# Altium project LEDController_NC-1.PrjPcb (part 3 of 3)
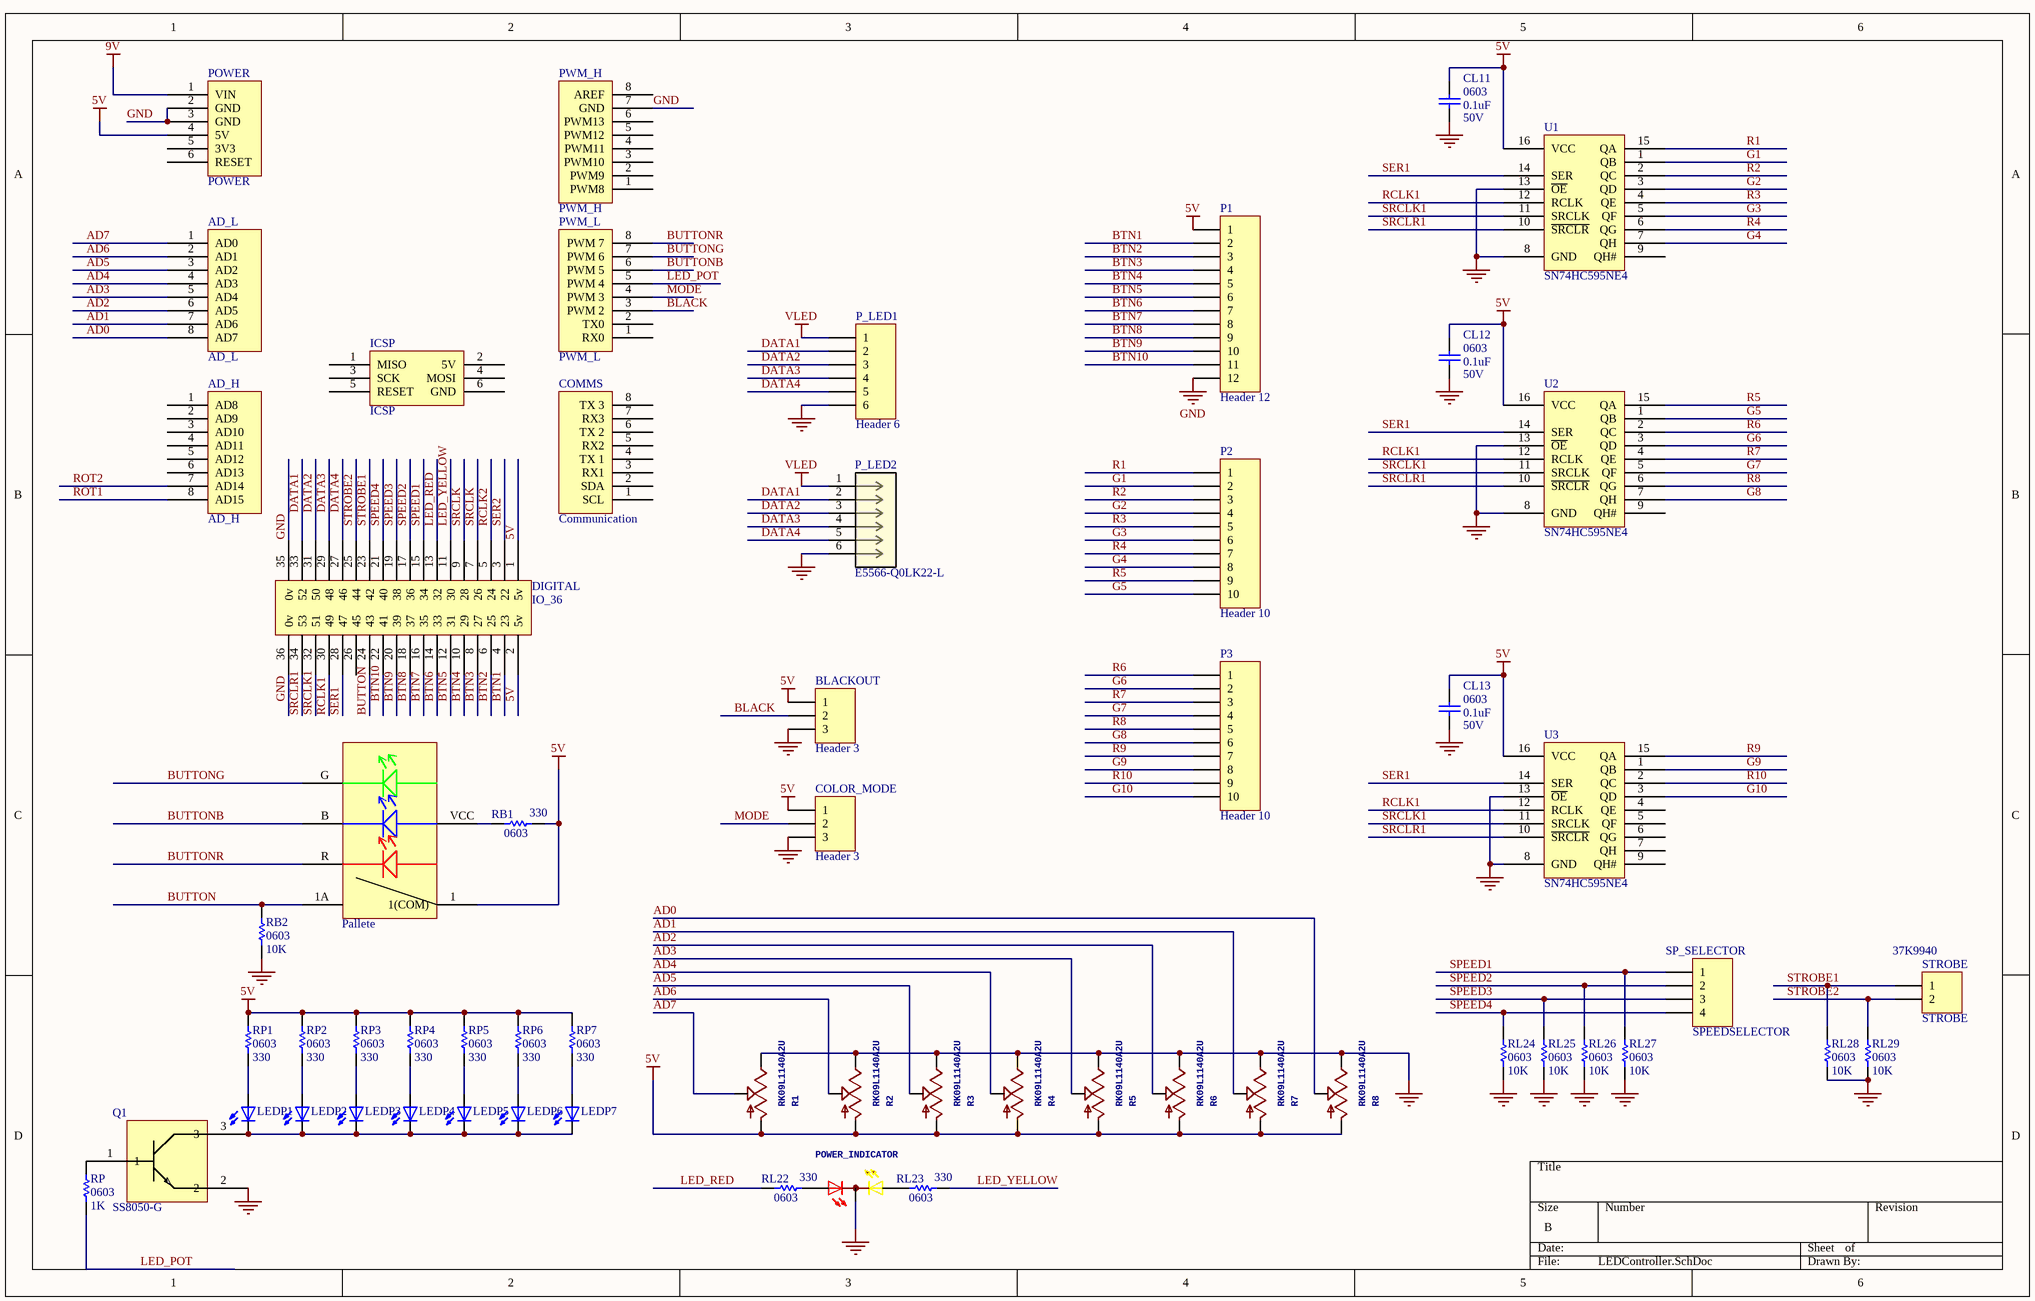
[diagram p4: LEDController.SchDoc]

## Sheet LEDController.SchDoc (continued)

### Library data of the parts
AD_H = AD_H: CONN HEADER VERT 8POS 2.54MM; Manufacturer 1: Sullins; Manufacturer Part Number 1: PREC008SFAN-RC; Number of Positions: 8; Connector Type: Male Pin; Pitch: 0.1inch; Supplier 1: Digi-Key; Supplier Part Number 1: S1212EC-08-ND; Stock 1: 3866; Pricing 1: 1=0.22000, 10=0.20200, 25=0.17200, 50=0.15060, 100=0.13980, 250=0.12364, 500=0.11828 (USD); RoHS: Yes; Mount: Through Hole; Color: Black; Contact Plating: Tin; Package Quantity: 1; Number of Rows: 1; Packaging: Bulk; Termination: Solder; Contact Mating Length: 0.318inch; ComponentLink1URL: https://datasheet.ciiva.com/740/xrxczzzsxxn-rc-st-11635-b-740957.pdf?src-supplier=Digi-Key; ComponentLink1Description: https://datasheet.ciiva.com/740/xrxczzzsxxn-rc-st-11635-b-740957.pdf?src-supplier=Digi-Key
AD_L = AD_L: CONN HEADER VERT 8POS 2.54MM; Manufacturer 1: Sullins; Manufacturer Part Number 1: PREC008SFAN-RC; Number of Positions: 8; Connector Type: Male Pin; Pitch: 0.1inch; Supplier 1: Digi-Key; Supplier Part Number 1: S1212EC-08-ND; Stock 1: 3866; Pricing 1: 1=0.22000, 10=0.20200, 25=0.17200, 50=0.15060, 100=0.13980, 250=0.12364, 500=0.11828 (USD); RoHS: Yes; Mount: Through Hole; Color: Black; Contact Plating: Tin; Package Quantity: 1; Number of Rows: 1; Packaging: Bulk; Termination: Solder; Contact Mating Length: 0.318inch; ComponentLink1URL: https://datasheet.ciiva.com/740/xrxczzzsxxn-rc-st-11635-b-740957.pdf?src-supplier=Digi-Key; ComponentLink1Description: https://datasheet.ciiva.com/740/xrxczzzsxxn-rc-st-11635-b-740957.pdf?src-supplier=Digi-Key
BLACKOUT COLOR_MODE = Header 3: CONN HEADER VERT 3POS 2MM; Manufacturer 1: JST; Number of Positions: 3; Connector Type: Male Pin; Current Rating: 2A; Contact Resistance: 20mR; Voltage Rating (AC): 100V; Insulation Resistance: 1MR; Gender: Male; LatestRevisionDate: 17-Jul-2002; LatestRevisionNote: Re-released for DXP Platform.; Publisher: Altium Limited; Supplier 1: Digi-Key; Supplier Part Number 1: 455-1705-ND; Manufacturer Part Number 1: B3B-PH-K-S(LF)(SN); Stock 1: 143844; Pricing 1: 1=0.19000, 10=0.18200, 100=0.12620, 500=0.10676, 1000=0.08736, 5000=0.07765, 10000=0.07037 (USD); RoHS: Yes; Mount: Through Hole; Number of Pins: 3; Contact Plating: Tin,Copper; Color: Natural; Contact Material: Brass,Tin; Housing Color: White; Housing Material: Polyamide; Min Operating Temperature: -25°C; Max Operating Temperature: 85°C; Number of Rows: 1; Packaging: Bulk; Max Current Rating: 2A; Number of Poles: 3; Voltage Rating: 100V; Termination: Solder; Fastening Type: Detent; Number of Contacts: 3; Max Voltage Rating (AC): 100V; Max Voltage Rating (DC): 100V; Working Voltage: 100V; Orientation: Straight; Length: 7.9mm; Height: 9.4mm; Pitch: 2mm; Width: 4.5mm; Lead Pitch: 2mm; Contact Mating Length: 0.13inch; Depth: 4.5mm; Lead Free: Lead Free; REACH SVHC: No SVHC; ComponentLink1URL: https://datasheet.ciiva.com/6747/80560-6747401.pdf?src-supplier=Newark; ComponentLink1Description: https://datasheet.ciiva.com/6747/80560-6747401.pdf?src-supplier=Newark; ComponentLink2URL: https://datasheet.ciiva.com/11746/0900766b80826550-11746939.pdf?src-supplier=RSComponents; ComponentLink2Description: https://datasheet.ciiva.com/11746/0900766b80826550-11746939.pdf?src-supplier=RSComponents; ComponentLink3URL: https://datasheet.ciiva.com/26894/getdatasheetpartid-448114-26894774.pdf?src-supplier=Verical; ComponentLink3Description: https://datasheet.ciiva.com/26894/getdatasheetpartid-448114-26894774.pdf?src-supplier=Verical; ComponentLink4URL: https://datasheet.ciiva.com/712/eph-712455.pdf?src-supplier=Digi-Key; ComponentLink4Description: https://datasheet.ciiva.com/712/eph-712455.pdf?src-supplier=Digi-Key; ComponentLink5URL: https://datasheet.ciiva.com/26924/getdatasheetpartid-651387-26924028.pdf?src-supplier=Verical; ComponentLink5Description: https://datasheet.ciiva.com/26924/getdatasheetpartid-651387-26924028.pdf?src-supplier=Verical; ComponentLink6URL: https://datasheet.ciiva.com/16200/eph-16200926.pdf?src-supplier=Future+Electronics; ComponentLink6Description: https://datasheet.ciiva.com/16200/eph-16200926.pdf?src-supplier=Future+Electronics; ComponentLink7URL: https://datasheet.ciiva.com/43491/741202-da-01-en-stiftleiste-gerade-3-pol-rm2-0-43491962.pdf?src-supplier=Conrad; ComponentLink7Description: https://datasheet.ciiva.com/43491/741202-da-01-en-stiftleiste-gerade-3-pol-rm2-0-43491962.pdf?src-supplier=Conrad
CL11-CL13 = Cap: CAP CER 0.1UF 50V X5R 0603; Manufacturer 1: Yageo; Manufacturer Part Number 1: CC0603KRX5R9BB104; Capacitance: 100nF; Tolerance: 10%; ComponentLink1URL: https://datasheet.ciiva.com/30062/tmk212bbj106kg-t-30062083.pdf?src-supplier=Onlinecomponents.com; ComponentLink1Description: https://datasheet.ciiva.com/30062/tmk212bbj106kg-t-30062083.pdf?src-supplier=Onlinecomponents.com; ComponentLink2URL: https://datasheet.ciiva.com/139/mlcc-all-e-139570.pdf?src-supplier=Digi-Key; ComponentLink2Description: https://datasheet.ciiva.com/139/mlcc-all-e-139570.pdf?src-supplier=Digi-Key; ComponentLink3URL: https://datasheet.ciiva.com/139/mlcc-all-e-139571.pdf?src-supplier=Digi-Key; ComponentLink3Description: https://datasheet.ciiva.com/139/mlcc-all-e-139571.pdf?src-supplier=Digi-Key; ComponentLink4URL: https://datasheet.ciiva.com/139/mlcc-all-e-139572.pdf?src-supplier=Digi-Key; ComponentLink4Description: https://datasheet.ciiva.com/139/mlcc-all-e-139572.pdf?src-supplier=Digi-Key; ComponentLink5URL: https://datasheet.ciiva.com/7975/1481447-7975820.pdf?src-supplier=Element14; ComponentLink5Description: https://datasheet.ciiva.com/7975/1481447-7975820.pdf?src-supplier=Element14; ComponentLink6URL: https://datasheet.ciiva.com/144/mlccorderingcode-144037.pdf?src-supplier=Digi-Key; ComponentLink6Description: https://datasheet.ciiva.com/144/mlccorderingcode-144037.pdf?src-supplier=Digi-Key; ComponentLink7URL: https://datasheet.ciiva.com/8033/1489800-8033669.pdf?src-supplier=Element14; ComponentLink7Description: https://datasheet.ciiva.com/8033/1489800-8033669.pdf?src-supplier=Element14; ComponentLink8URL: https://datasheet.ciiva.com/15189/getdatasheetpartid-321421-15189125.pdf?src-supplier=Verical; ComponentLink8Description: https://datasheet.ciiva.com/15189/getdatasheetpartid-321421-15189125.pdf?src-supplier=Verical; ComponentLink9URL: https://datasheet.ciiva.com/144/mlccorderingcode-144038.pdf?src-supplier=Digi-Key; ComponentLink9Description: https://datasheet.ciiva.com/144/mlccorderingcode-144038.pdf?src-supplier=Digi-Key; ComponentLink10URL: https://datasheet.ciiva.com/28450/1489800-28450342.pdf?src-supplier=Element14; ComponentLink10Description: https://datasheet.ciiva.com/28450/1489800-28450342.pdf?src-supplier=Element14; ComponentLink11URL: https://datasheet.ciiva.com/144/mlccorderingcode-144039.pdf?src-supplier=Digi-Key; ComponentLink11Description: https://datasheet.ciiva.com/144/mlccorderingcode-144039.pdf?src-supplier=Digi-Key; ComponentLink12URL: https://datasheet.ciiva.com/8033/1489800-8033671.pdf?src-supplier=Element14; ComponentLink12Description: https://datasheet.ciiva.com/8033/1489800-8033671.pdf?src-supplier=Element14; ComponentLink13URL: http://www.farnell.com/datasheets/1872206.pdf?src-supplier=Farnell; ComponentLink13Description: http://www.farnell.com/datasheets/1872206.pdf?src-supplier=Farnell; ComponentLink14URL: http://uk.rs-online.com/webdocs/144c/0900766b8144c113.pdf?src-supplier=RSComponents; ComponentLink14Description: http://uk.rs-online.com/webdocs/144c/0900766b8144c113.pdf?src-supplier=RSComponents; ComponentLink15URL: http://www.farnell.com/datasheets/2048008.pdf?src-supplier=Farnell; ComponentLink15Description: http://www.farnell.com/datasheets/2048008.pdf?src-supplier=Farnell; ComponentLink16URL: http://www.mouser.com/ds/2/281/c02e-2905.pdf?src-supplier=Mouser; ComponentLink16Description: http://www.mouser.com/ds/2/281/c02e-2905.pdf?src-supplier=Mouser; ComponentLink17URL: http://components.arrow.com/part/dataview/0323_06361249?src-supplier=Arrow+Europe; ComponentLink17Description: http://components.arrow.com/part/dataview/0323_06361249?src-supplier=Arrow+Europe; ComponentLink18URL: https://search.murata.co.jp/Ceramy/image/img/A01X/G101/ENG/GRM155R71E104KE14-01.pdf?src-supplier=Digi-Key; ComponentLink18Description: https://search.murata.co.jp/Ceramy/image/img/A01X/G101/ENG/GRM155R71E104KE14-01.pdf?src-supplier=Digi-Key; ComponentLink19URL: http://www.farnell.com/datasheets/2048008.pdf?src-supplier=Newark; ComponentLink19Description: http://www.farnell.com/datasheets/2048008.pdf?src-supplier=Newark; ComponentLink20URL: http://psearch.en.murata.com/capacitor/product/GRM155R71E104KE14%23.pdf?src-supplier=Avnet; ComponentLink20Description: http://psearch.en.murata.com/capacitor/product/GRM155R71E104KE14%23.pdf?src-supplier=Avnet; ComponentLink21URL: http://www.farnell.com/datasheets/2048008.pdf?src-supplier=Element14; ComponentLink21Description: http://www.farnell.com/datasheets/2048008.pdf?src-supplier=Element14; Supplier 1: Digi-Key; Supplier Part Number 1: 311-4046-1-ND; Stock 1: 3816; Pricing 1: 1=0.10000, 10=0.05600, 50=0.03080, 100=0.02510, 500=0.01794, 1000=0.01410 (USD); RoHS: Yes; Mount: Surface Mount; Case/Package: 0603; Case Code (Imperial): 0603; Case Code (Metric): 1608; Weight: 7.1E-05oz; Min Operating Temperature: -55°C; Max Operating Temperature: 85°C; Packaging: Tape and Reel; Dielectric: X5R; Termination: SMD/SMT; Voltage Rating (DC): 50V; Package Quantity: 4000; Length: 0.063inch; Width: 0.031inch; Thickness: 0.035inch; Lead Free: Lead Free; Halogen Free: Halogen Free; ComponentLink22URL: http://www.mouser.com/ds/2/447/Yageo_UPY-GP_NP0_16V-to-50V_9-358835.pdf?src-supplier=Mouser; ComponentLink22Description: http://www.mouser.com/ds/2/447/Yageo_UPY-GP_NP0_16V-to-50V_9-358835.pdf?src-supplier=Mouser; ComponentLink23URL: http://www.yageo.com/documents/recent/UPY-GPHC_X5R_4V-to-50V_25.pdf?src-supplier=Digi-Key; ComponentLink23Description: http://www.yageo.com/documents/recent/UPY-GPHC_X5R_4V-to-50V_25.pdf?src-supplier=Digi-Key; ComponentLink24URL: http://www.yageo.com/exep/pages/download/literatures/ProductSelectionGuide%202014_Final_2.pdf?src-supplier=Digi-Key; ComponentLink24Description: http://www.yageo.com/exep/pages/download/literatures/ProductSelectionGuide%202014_Final_2.pdf?src-supplier=Digi-Key
COMMS = Communication: CONN HEADER VERT 8POS 2.54MM; Manufacturer 1: Sullins; Manufacturer Part Number 1: PREC008SFAN-RC; Number of Positions: 8; Connector Type: Male Pin; Pitch: 0.1inch; Supplier 1: Digi-Key; Supplier Part Number 1: S1212EC-08-ND; Stock 1: 3866; Pricing 1: 1=0.22000, 10=0.20200, 25=0.17200, 50=0.15060, 100=0.13980, 250=0.12364, 500=0.11828 (USD); RoHS: Yes; Mount: Through Hole; Color: Black; Contact Plating: Tin; Package Quantity: 1; Number of Rows: 1; Packaging: Bulk; Termination: Solder; Contact Mating Length: 0.318inch; ComponentLink1URL: https://datasheet.ciiva.com/740/xrxczzzsxxn-rc-st-11635-b-740957.pdf?src-supplier=Digi-Key; ComponentLink1Description: https://datasheet.ciiva.com/740/xrxczzzsxxn-rc-st-11635-b-740957.pdf?src-supplier=Digi-Key
DIGITAL = IO_36: CONN HEADER VERT 36POS 2.54MM; Manufacturer 1: Sullins; Manufacturer Part Number 1: PREC018DFAN-RC; Number of Positions: 36; Connector Type: Male Pin; Pitch: 0.1inch; Supplier 1: Digi-Key; Supplier Part Number 1: S2212EC-18-ND; Stock 1: 291; Pricing 1: 1=0.77000, 10=0.72600, 25=0.65320, 50=0.58060, 100=0.55640, 250=0.50804, 500=0.48384 (USD); RoHS: Yes; Mount: Through Hole; Color: Black; Contact Plating: Tin; Package Quantity: 1; Number of Rows: 2; Packaging: Bulk; Termination: Solder; Series: -; Contact Type: Male Pin; Row Spacing: 0.1inch; Contact Mating Length: 0.318inch; RoHS Compliant: Yes; ComponentLink1URL: https://datasheet.ciiva.com/740/xrxczzzdxxn-rc-11636-b-740987.pdf?src-supplier=Digi-Key; ComponentLink1Description: https://datasheet.ciiva.com/740/xrxczzzdxxn-rc-11636-b-740987.pdf?src-supplier=Digi-Key
LEDP1-LEDP7 = 150060AS75000: Amber 605nm LED Indication - Discrete 2V 0603 (1608 Metric); Manufacturer 1: Wurth Electronics; ComponentLink1URL: http://optoelectronics.liteon.com/upload/download/DS22-2000-074/S_110_LTST-C190KGKT.pdf; ComponentLink1Description: http://optoelectronics.liteon.com/upload/download/DS22-2000-074/S_110_LTST-C190KGKT.pdf; ComponentLink2URL: https://datasheet.ciiva.com/19482/1260381-19482354.pdf?src-supplier=Jameco; ComponentLink2Description: https://datasheet.ciiva.com/19482/1260381-19482354.pdf?src-supplier=Jameco; ComponentLink3URL: https://datasheet.ciiva.com/12403/100-ltst-c190krkt-59805-12403895.pdf?src-supplier=Mouser; ComponentLink3Description: https://datasheet.ciiva.com/12403/100-ltst-c190krkt-59805-12403895.pdf?src-supplier=Mouser; ComponentLink4URL: https://datasheet.ciiva.com/15117/getdatasheetpartid-57395-15117240.pdf?src-supplier=Verical; ComponentLink4Description: https://datasheet.ciiva.com/15117/getdatasheetpartid-57395-15117240.pdf?src-supplier=Verical; ComponentLink5URL: https://datasheet.ciiva.com/16427/ltst-c190krkt-16427674.pdf?src-supplier=Future+Electronics; ComponentLink5Description: https://datasheet.ciiva.com/16427/ltst-c190krkt-16427674.pdf?src-supplier=Future+Electronics; ComponentLink6URL: https://datasheet.ciiva.com/11774/0900766b80dc02a9-11774043.pdf?src-supplier=RSComponents; ComponentLink6Description: https://datasheet.ciiva.com/11774/0900766b80dc02a9-11774043.pdf?src-supplier=RSComponents; ComponentLink7URL: https://datasheet.ciiva.com/26937/getdatasheetpartid-631582-26937958.pdf?src-supplier=Verical; ComponentLink7Description: https://datasheet.ciiva.com/26937/getdatasheetpartid-631582-26937958.pdf?src-supplier=Verical; ComponentLink8URL: https://datasheet.ciiva.com/2109/s-110-ltst-c190krkt-2109991.pdf?src-supplier=Digi-Key; ComponentLink8Description: https://datasheet.ciiva.com/2109/s-110-ltst-c190krkt-2109991.pdf?src-supplier=Digi-Key; ComponentLink9URL: https://datasheet.ciiva.com/2109/s-110-ltst-c190krkt-2109992.pdf?src-supplier=Digi-Key; ComponentLink9Description: https://datasheet.ciiva.com/2109/s-110-ltst-c190krkt-2109992.pdf?src-supplier=Digi-Key; ComponentLink10URL: https://datasheet.ciiva.com/2109/s-110-ltst-c190krkt-2109993.pdf?src-supplier=Digi-Key; ComponentLink10Description: https://datasheet.ciiva.com/2109/s-110-ltst-c190krkt-2109993.pdf?src-supplier=Digi-Key; Supplier 1: Digi-Key; Manufacturer Part Number 1: 150060AS75000; Stock 1: 5248; Pricing 1: 1=0.14000, 50=0.13300, 100=0.11400, 500=0.09900 (USD); RoHS: No; ComponentLink11URL: http://www.farnell.com/datasheets/2621639.pdf?src-supplier=Farnell; ComponentLink11Description: http://www.farnell.com/datasheets/2621639.pdf?src-supplier=Farnell; ComponentLink12URL: http://www.farnell.com/datasheets/2621639.pdf?src-supplier=Element14; ComponentLink12Description: http://www.farnell.com/datasheets/2621639.pdf?src-supplier=Element14; ComponentLink13URL: http://www.farnell.com/datasheets/2621639.pdf?src-supplier=Newark; ComponentLink13Description: http://www.farnell.com/datasheets/2621639.pdf?src-supplier=Newark; Supplier Part Number 1: 732-150060AS75000CT-ND
P1 = Header 12: CONN HEADER VERT 12POS 2.54MM; Manufacturer 1: Sullins; Manufacturer Part Number 1: PREC012SFAN-RC; Number of Positions: 12; Connector Type: Male Pin; Pitch: 0.1inch; ComponentLink1URL: https://datasheet.ciiva.com/740/xrxczzzsxxn-rc-st-11635-b-740955.pdf?src-supplier=Digi-Key; ComponentLink1Description: https://datasheet.ciiva.com/740/xrxczzzsxxn-rc-st-11635-b-740955.pdf?src-supplier=Digi-Key; Supplier 1: Digi-Key; Supplier Part Number 1: S1212EC-12-ND; Stock 1: 741; Pricing 1: 1=0.30000, 10=0.28200, 25=0.24200, 50=0.20560, 100=0.19760, 250=0.17740, 500=0.16934 (USD); RoHS: Yes; Mount: Through Hole; Contact Plating: Tin; Color: Black; Termination: Solder; Package Quantity: 1; Number of Rows: 1; Packaging: Bulk; Contact Mating Length: 0.318inch; ComponentLink2URL: https://datasheet.ciiva.com/740/xrxczzzsxxn-rc-st-11635-b-740953.pdf?src-supplier=Digi-Key; ComponentLink2Description: https://datasheet.ciiva.com/740/xrxczzzsxxn-rc-st-11635-b-740953.pdf?src-supplier=Digi-Key
P2 P3 = Header 10: CONN HEADER VERT 10POS 2.54MM; Manufacturer 1: Sullins; Manufacturer Part Number 1: PREC010SFAN-RC; Number of Positions: 10; Connector Type: Male Pin; Pitch: 0.1inch; LatestRevisionDate: 17-Jul-2002; LatestRevisionNote: Re-released for DXP Platform.; Publisher: Altium Limited; Supplier 1: Digi-Key; Supplier Part Number 1: S1212EC-10-ND; Stock 1: 7881; Pricing 1: 1=0.27000, 10=0.25200, 25=0.21520, 50=0.18820, 100=0.17470, 250=0.15456, 500=0.14784 (USD); RoHS: Yes; Mount: Through Hole; Color: Black; Contact Plating: Tin; Termination: Solder; Package Quantity: 1; Number of Rows: 1; Packaging: Bulk; Contact Mating Length: 0.318inch; ComponentLink1URL: https://datasheet.ciiva.com/740/xrxczzzsxxn-rc-st-11635-b-740955.pdf?src-supplier=Digi-Key; ComponentLink1Description: https://datasheet.ciiva.com/740/xrxczzzsxxn-rc-st-11635-b-740955.pdf?src-supplier=Digi-Key
P_LED1 = Header 6: CONN HEADER VERT 6POS 2.54MM; Manufacturer 1: Sullins; Manufacturer Part Number 1: PREC006SFAN-RC; Number of Positions: 6; Connector Type: Male Pin; Pitch: 0.1inch; LatestRevisionDate: 17-Jul-2002; LatestRevisionNote: Re-released for DXP Platform.; Publisher: Altium Limited; Supplier 1: Digi-Key; Supplier Part Number 1: S1212EC-06-ND; Stock 1: 3553; Pricing 1: 1=0.16000, 10=0.15100, 25=0.12920, 50=0.11280, 100=0.10480, 250=0.09272, 500=0.08870 (USD); RoHS: Yes; Mount: Through Hole; Color: Black; Contact Plating: Tin; Package Quantity: 1; Number of Rows: 1; Packaging: Bulk; Termination: Solder; Series: -; Contact Type: Male Pin; Contact Mating Length: 0.318inch; RoHS Compliant: Yes; ComponentLink1URL: https://datasheet.ciiva.com/740/xrxczzzsxxn-rc-st-11635-b-740959.pdf?src-supplier=Digi-Key; ComponentLink1Description: https://datasheet.ciiva.com/740/xrxczzzsxxn-rc-st-11635-b-740959.pdf?src-supplier=Digi-Key
P_LED2 = E5566-Q0LK22-L: CONN MOD JACK 6P6C R/A UNSHLD; Manufacturer 1: Pulse; Built_By: EMA_Don; Vendor: Pulse Electronics Corporation; SourceLibrary: Pulse_Electronics_2018-08-17; Number of Ports: 1; Direction: Up; Number of Contacts: 6; Shielding: Unshielded; Pitch: 1.02mm; Copyright: Copyright (C) 2016 Accelerated Designs. All rights reserved; Manufacturer_Part_Number: E5566-Q0LK22-L; RefDes: RefDes; Type: DEV; Supplier 1: Digi-Key; Manufacturer Part Number 1: E5566-Q0LK22-L; Stock 1: 13841; Pricing 1: 1=0.54000, 10=0.51000, 25=0.45920, 50=0.40800, 100=0.39100, 250=0.35700, 500=0.34000, 1000=0.28050, 2500=0.25500 (USD); RoHS: Yes; Mount: Through Hole; Housing Material: Nylon; Contact Plating: Gold; Contact Material: Bronze; Min Operating Temperature: -40°C; Max Operating Temperature: 85°C; Termination: Solder; Packaging: Bulk; Package Quantity: 4080; Orientation: Right Angle; Number of Rows: 1; Connector Type: Jack; Radiation Hardening: No; ComponentLink1URL: https://datasheet.ciiva.com/686/+ce553027-lc-686555.pdf?src-supplier=Digi-Key; ComponentLink1Description: https://datasheet.ciiva.com/686/+ce553027-lc-686555.pdf?src-supplier=Digi-Key; Supplier Part Number 1: 553-2258-ND
Pallete = KP0115ANBKG03RGB-2SJB: Pushbutton Switch SPST-NO Standard, Illuminated Through Hole; Manufacturer 1: NKK Switches; Actuator Material: Polyacetal; Mechanical Life: 5000000Cycles; Illumination Color: Blue,Green,Red; Throw Configuration: SPST; Max Current Rating: 100mA; Illumination Type: LED; Voltage Rating (DC): 12V; Actuator Type: Square, Button; Switch Function: Off-Mom; Supplier 1: Digi-Key; Manufacturer Part Number 1: KP0115ANBKG03RGB-2SJB; Stock 1: 22; Pricing 1: 1=20.27000, 10=18.40500, 25=17.57800, 50=16.64740, 100=16.02700, 250=14.99300, 500=12.40800 (USD); RoHS: Yes; Mount: Through Hole; Contact Material: Stainless Steel; Contact Plating: Gold; Housing Material: Glass fibre; Min Operating Temperature: -25°C; Max Operating Temperature: 50°C; Current Rating: 100mA; Package Quantity: 1; Packaging: Bulk; Max Voltage Rating (DC): 12V; Termination: PC Pins; Electrical Life: 5000000Cycles; Length: 17.4mm; Depth: 17.4mm; Lead Free: Lead Free; ComponentLink1URL: https://datasheet.ciiva.com/16864/70192969-16864678.pdf?src-supplier=Allied+Electronics; ComponentLink1Description: https://datasheet.ciiva.com/16864/70192969-16864678.pdf?src-supplier=Allied+Electronics; ComponentLink2URL: https://datasheet.ciiva.com/2870/kp01-2870071.pdf?src-supplier=Digi-Key; ComponentLink2Description: https://datasheet.ciiva.com/2870/kp01-2870071.pdf?src-supplier=Digi-Key; Supplier Part Number 1: 360-2465-ND
POWER = POWER: CONN HEADER VERT 6POS 2.54MM; Manufacturer 1: Sullins; Manufacturer Part Number 1: PREC006SFAN-RC; Number of Positions: 6; Connector Type: Male Pin; Pitch: 0.1inch; Supplier 1: Digi-Key; Supplier Part Number 1: S1212EC-06-ND; Stock 1: 3553; Pricing 1: 1=0.16000, 10=0.15100, 25=0.12920, 50=0.11280, 100=0.10480, 250=0.09272, 500=0.08870 (USD); RoHS: Yes; Mount: Through Hole; Color: Black; Contact Plating: Tin; Package Quantity: 1; Number of Rows: 1; Packaging: Bulk; Termination: Solder; Series: -; Contact Type: Male Pin; Contact Mating Length: 0.318inch; RoHS Compliant: Yes; ComponentLink1URL: https://datasheet.ciiva.com/740/xrxczzzsxxn-rc-st-11635-b-740959.pdf?src-supplier=Digi-Key; ComponentLink1Description: https://datasheet.ciiva.com/740/xrxczzzsxxn-rc-st-11635-b-740959.pdf?src-supplier=Digi-Key
POWER_INDICATOR = WP59EYW: Red, Yellow 617nm Red, 588nm Yellow LED Indication - Discrete 2V Red, 2.1V Yellow Radial - 3 Leads; Manufacturer 1: Kingbright; Lens Color: White; Test Current: 20mA; Forward Current: 30mA; Number of LEDs: 1; Lens Style: Dome,Diffused,Round; Viewing Angle: 60°; Luminous Intensity: 40mcd; Wavelength: 568nm; Supplier 1: Digi-Key; Manufacturer Part Number 1: WP59EYW; Stock 1: 1988; Pricing 1: 1=0.62000, 10=0.44600, 100=0.29120, 500=0.20930, 1000=0.16380, 2500=0.15015, 5000=0.13650, 10000=0.12740, 25000=0.12285 (USD); RoHS: Yes; Mount: Through Hole; Case/Package: Radial; Number of Pins: 5; Color: Red,Yellow; Min Operating Temperature: -40°C; Max Operating Temperature: 85°C; Dominant Wavelength: 588nm; Forward Voltage: 2.1V; Package Quantity: 500; Illumination Color: Red,Yellow; Packaging: Bulk; Height: 8.6mm; Lead Free: Lead Free; ComponentLink1URL: https://datasheet.ciiva.com/16366/wp59eyw-16366834.pdf?src-supplier=Future+Electronics; ComponentLink1Description: https://datasheet.ciiva.com/16366/wp59eyw-16366834.pdf?src-supplier=Future+Electronics; ComponentLink2URL: https://datasheet.ciiva.com/13500/wp59eyw-45838-13500845.pdf?src-supplier=Mouser; ComponentLink2Description: https://datasheet.ciiva.com/13500/wp59eyw-45838-13500845.pdf?src-supplier=Mouser; ComponentLink3URL: https://datasheet.ciiva.com/14604/70062955-14604373.pdf?src-supplier=Allied+Electronics; ComponentLink3Description: https://datasheet.ciiva.com/14604/70062955-14604373.pdf?src-supplier=Allied+Electronics; Supplier Part Number 1: 754-1233-ND
PWM_H = PWM_H: CONN HEADER VERT 8POS 2.54MM; Manufacturer 1: Sullins; Manufacturer Part Number 1: PREC008SFAN-RC; Number of Positions: 8; Connector Type: Male Pin; Pitch: 0.1inch; Supplier 1: Digi-Key; Supplier Part Number 1: S1212EC-08-ND; Stock 1: 3866; Pricing 1: 1=0.22000, 10=0.20200, 25=0.17200, 50=0.15060, 100=0.13980, 250=0.12364, 500=0.11828 (USD); RoHS: Yes; Mount: Through Hole; Color: Black; Contact Plating: Tin; Package Quantity: 1; Number of Rows: 1; Packaging: Bulk; Termination: Solder; Contact Mating Length: 0.318inch; ComponentLink1URL: https://datasheet.ciiva.com/740/xrxczzzsxxn-rc-st-11635-b-740957.pdf?src-supplier=Digi-Key; ComponentLink1Description: https://datasheet.ciiva.com/740/xrxczzzsxxn-rc-st-11635-b-740957.pdf?src-supplier=Digi-Key
PWM_L = PWM_L: CONN HEADER VERT 8POS 2.54MM; Manufacturer 1: Sullins; Manufacturer Part Number 1: PREC008SFAN-RC; Number of Positions: 8; Connector Type: Male Pin; Pitch: 0.1inch; Supplier 1: Digi-Key; Supplier Part Number 1: S1212EC-08-ND; Stock 1: 3866; Pricing 1: 1=0.22000, 10=0.20200, 25=0.17200, 50=0.15060, 100=0.13980, 250=0.12364, 500=0.11828 (USD); RoHS: Yes; Mount: Through Hole; Color: Black; Contact Plating: Tin; Package Quantity: 1; Number of Rows: 1; Packaging: Bulk; Termination: Solder; Contact Mating Length: 0.318inch; ComponentLink1URL: https://datasheet.ciiva.com/740/xrxczzzsxxn-rc-st-11635-b-740957.pdf?src-supplier=Digi-Key; ComponentLink1Description: https://datasheet.ciiva.com/740/xrxczzzsxxn-rc-st-11635-b-740957.pdf?src-supplier=Digi-Key
Q1 = SS8050-G: Bipolar (BJT) Transistor NPN 25V 1.5A 100MHz 300mW Surface Mount SOT-23; Vendor: Comchip; Built_By: EMA_Kyle; SourceLibrary: Comchip_2020-02-14; Type: DEV; Collector Emitter Voltage (VCEO): 400mV; Manufacturer_Part_Number: SS8050-G; Copyright: Copyright (C) 2018 Accelerated Designs. All rights reserved; RefDes: RefDes; Supplier 1: Digi-Key; Manufacturer 1: Comchip; Manufacturer Part Number 1: SS8050-G; Stock 1: 8356; Pricing 1: 1=0.21000, 10=0.17400, 25=0.14600, 100=0.07130, 500=0.05946, 1000=0.04131 (USD); RoHS: Yes; Mount: Surface Mount; Case/Package: TO-236-3; Packaging: Tape and Reel; Max Collector Current: 1.5A; Max Power Dissipation: 300mW; Transition Frequency: 100MHz; Collector Emitter Breakdown Voltage: 25V; Max Breakdown Voltage: 25V; ComponentLink1URL: http://www.comchiptech.com/admin/files/product/SS8050-G RevA181526.pdf?src-supplier=Digi-Key; ComponentLink1Description: http://www.comchiptech.com/admin/files/product/SS8050-G RevA181526.pdf?src-supplier=Digi-Key; ComponentLink2URL: http://www.comchiptech.com/cms/UserFiles/SS8050-G%20RevA181526.pdf?src-supplier=Digi-Key; ComponentLink2Description: http://www.comchiptech.com/cms/UserFiles/SS8050-G%20RevA181526.pdf?src-supplier=Digi-Key; Supplier Part Number 1: 641-1790-1-ND
R1-R8 = US-EVUM: Potentiometers Sgl Unit Vert Flat Snap-in 10K Ohms 20%; Manufacturer 1: Alps Electric; Resistance: 10kR; Power Rating: 50mW; Number of Turns: 1; Hole Diameter: 9mm; ComponentLink1URL: https://datasheet.ciiva.com/30236/aok0000ce4-30236166.pdf?src-supplier=Onlinecomponents.com; ComponentLink1Description: https://datasheet.ciiva.com/30236/aok0000ce4-30236166.pdf?src-supplier=Onlinecomponents.com; ComponentLink2URL: https://datasheet.ciiva.com/16928/70270572-16928811.pdf?src-supplier=Allied+Electronics; ComponentLink2Description: https://datasheet.ciiva.com/16928/70270572-16928811.pdf?src-supplier=Allied+Electronics; ComponentLink3URL: https://datasheet.ciiva.com/48425/p260-eng-tds-48425286.pdf?src-supplier=Distrelec; ComponentLink3Description: https://datasheet.ciiva.com/48425/p260-eng-tds-48425286.pdf?src-supplier=Distrelec; Supplier 1: Mouser; Supplier Part Number 1: 688-RK09L1140A2U; Manufacturer Part Number 1: RK09L1140A2U; Stock 1: 3048; Pricing 1: 1=1.49000, 25=1.31000, 50=1.23000, 100=1.19000, 500=1.10000, 1000=1.07000 (USD); RoHS: Yes; Mount: Panel,Brackets,Through Hole; Min Operating Temperature: -10°C; Max Operating Temperature: 70°C; Tolerance: 20%; Type: Potentiometer; Packaging: Tray; Resistor Type: Potentiometer; Taper: Linear; Termination: Pin; Length: 10.7mm; Depth: 7.45mm; Radiation Hardening: No; ComponentLink4URL: https://datasheet.ciiva.com/11831/0900766b80f4c570-11831530.pdf?src-supplier=RSComponents; ComponentLink4Description: https://datasheet.ciiva.com/11831/0900766b80f4c570-11831530.pdf?src-supplier=RSComponents
RB1 RL22 RL23 RP1-RP7 = Res1: RES SMD 330 OHM 1% 1/10W 0603; Manufacturer 1: Yageo; Manufacturer Part Number 1: RC0603FR-07330RL; Max Power Dissipation: 100mW; Temperature Coefficient: 100ppm/°C; Voltage Rating (DC): 50V; Resistance: 330R; ComponentLink1URL: https://datasheet.ciiva.com/11819/0900766b80c66297-11819490.pdf?src-supplier=RSComponents; ComponentLink1Description: https://datasheet.ciiva.com/11819/0900766b80c66297-11819490.pdf?src-supplier=RSComponents; ComponentLink2URL: https://datasheet.ciiva.com/7849/1018594-7849962.pdf?src-supplier=Element14; ComponentLink2Description: https://datasheet.ciiva.com/7849/1018594-7849962.pdf?src-supplier=Element14; ComponentLink3URL: https://datasheet.ciiva.com/17083/pyu-rc0402-51-rohs-l-6-r-17083994.pdf?src-supplier=Future+Electronics; ComponentLink3Description: https://datasheet.ciiva.com/17083/pyu-rc0402-51-rohs-l-6-r-17083994.pdf?src-supplier=Future+Electronics; ComponentLink4URL: https://datasheet.ciiva.com/7849/1018594-7849963.pdf?src-supplier=Element14; ComponentLink4Description: https://datasheet.ciiva.com/7849/1018594-7849963.pdf?src-supplier=Element14; ComponentLink5URL: https://datasheet.ciiva.com/2453/pyu-r-int-thick-7-2453661.pdf?src-supplier=Digi-Key; ComponentLink5Description: https://datasheet.ciiva.com/2453/pyu-r-int-thick-7-2453661.pdf?src-supplier=Digi-Key; ComponentLink6URL: https://datasheet.ciiva.com/2453/pyu-r-int-thick-7-2453662.pdf?src-supplier=Digi-Key; ComponentLink6Description: https://datasheet.ciiva.com/2453/pyu-r-int-thick-7-2453662.pdf?src-supplier=Digi-Key; ComponentLink7URL: https://datasheet.ciiva.com/2453/pyu-r-int-thick-7-2453663.pdf?src-supplier=Digi-Key; ComponentLink7Description: https://datasheet.ciiva.com/2453/pyu-r-int-thick-7-2453663.pdf?src-supplier=Digi-Key; ComponentLink8URL: https://datasheet.ciiva.com/12656/pyu-rc0402-51-rohs-l-6-r-12656815.pdf?src-supplier=Mouser; ComponentLink8Description: https://datasheet.ciiva.com/12656/pyu-rc0402-51-rohs-l-6-r-12656815.pdf?src-supplier=Mouser; Supplier 1: Digi-Key; Supplier Part Number 1: 311-330HRCT-ND; Stock 1: 3885547; Pricing 1: 1=0.10000, 10=0.02300, 100=0.00940, 1000=0.00421, 2500=0.00366 (USD); RoHS: Yes; Case/Package: 0603; Number of Pins: 2; Case Code (Metric): 1608; Case Code (Imperial): 0603; Min Operating Temperature: -55°C; Max Operating Temperature: 155°C; Composition: Thick Film; Features: Moisture Resistant; Number of Terminations: 2; Termination: SMD/SMT; Power Rating: 100mW; Tolerance: 1%; Voltage Rating: 50V; Packaging: Tape and Reel; Package Quantity: 1; Length: 1.6mm; Height: 0.45mm; Depth: 0.8mm; Width: 0.8mm; Lead Free: Lead Free; REACH SVHC: No SVHC; ComponentLink9URL: https://datasheet.ciiva.com/11819/0900766b80f96399-11819327.pdf?src-supplier=RSComponents; ComponentLink9Description: https://datasheet.ciiva.com/11819/0900766b80f96399-11819327.pdf?src-supplier=RSComponents; ComponentLink10URL: https://datasheet.ciiva.com/2454/pyu-r-int-thick-7-2454864.pdf?src-supplier=Digi-Key; ComponentLink10Description: https://datasheet.ciiva.com/2454/pyu-r-int-thick-7-2454864.pdf?src-supplier=Digi-Key; ComponentLink11URL: https://datasheet.ciiva.com/2454/pyu-r-int-thick-7-2454865.pdf?src-supplier=Digi-Key; ComponentLink11Description: https://datasheet.ciiva.com/2454/pyu-r-int-thick-7-2454865.pdf?src-supplier=Digi-Key; ComponentLink12URL: https://datasheet.ciiva.com/2454/pyu-r-int-thick-7-2454866.pdf?src-supplier=Digi-Key; ComponentLink12Description: https://datasheet.ciiva.com/2454/pyu-r-int-thick-7-2454866.pdf?src-supplier=Digi-Key; ComponentLink13URL: https://datasheet.ciiva.com/12555/rc0603-272842-12555334.pdf?src-supplier=Mouser; ComponentLink13Description: https://datasheet.ciiva.com/12555/rc0603-272842-12555334.pdf?src-supplier=Mouser; ComponentLink14URL: https://datasheet.ciiva.com/46440/1868787-46440904.pdf?src-supplier=Element14; ComponentLink14Description: https://datasheet.ciiva.com/46440/1868787-46440904.pdf?src-supplier=Element14; ComponentLink15URL: https://datasheet.ciiva.com/7746/443971-7746329.pdf?src-supplier=Element14; ComponentLink15Description: https://datasheet.ciiva.com/7746/443971-7746329.pdf?src-supplier=Element14; ComponentLink16URL: https://datasheet.ciiva.com/7746/443971-7746330.pdf?src-supplier=Element14; ComponentLink16Description: https://datasheet.ciiva.com/7746/443971-7746330.pdf?src-supplier=Element14; ComponentLink17URL: https://datasheet.ciiva.com/7746/1686128-7746331.pdf?src-supplier=Element14; ComponentLink17Description: https://datasheet.ciiva.com/7746/1686128-7746331.pdf?src-supplier=Element14
RB2 RL24-RL29 = Res1: RES SMD 10K OHM 5% 1/10W 0603; Manufacturer 1: Yageo; Manufacturer Part Number 1: RC0603JR-0710KL; Resistance: 10kR; Voltage Rating (DC): 50V; Temperature Coefficient: 100ppm/°C; Power Rating: 100mW; ComponentLink1URL: https://datasheet.ciiva.com/2452/pyu-r-int-thick-7-2452944.pdf?src-supplier=Digi-Key; ComponentLink1Description: https://datasheet.ciiva.com/2452/pyu-r-int-thick-7-2452944.pdf?src-supplier=Digi-Key; ComponentLink2URL: https://datasheet.ciiva.com/2452/pyu-r-int-thick-7-2452945.pdf?src-supplier=Digi-Key; ComponentLink2Description: https://datasheet.ciiva.com/2452/pyu-r-int-thick-7-2452945.pdf?src-supplier=Digi-Key; ComponentLink3URL: https://datasheet.ciiva.com/2452/pyu-r-int-thick-7-2452946.pdf?src-supplier=Digi-Key; ComponentLink3Description: https://datasheet.ciiva.com/2452/pyu-r-int-thick-7-2452946.pdf?src-supplier=Digi-Key; ComponentLink4URL: https://datasheet.ciiva.com/7746/443971-7746453.pdf?src-supplier=Element14; ComponentLink4Description: https://datasheet.ciiva.com/7746/443971-7746453.pdf?src-supplier=Element14; ComponentLink5URL: https://datasheet.ciiva.com/7746/443971-7746454.pdf?src-supplier=Element14; ComponentLink5Description: https://datasheet.ciiva.com/7746/443971-7746454.pdf?src-supplier=Element14; ComponentLink6URL: https://datasheet.ciiva.com/6063/1868787-6063175.pdf?src-supplier=Farnell; ComponentLink6Description: https://datasheet.ciiva.com/6063/1868787-6063175.pdf?src-supplier=Farnell; ComponentLink7URL: https://datasheet.ciiva.com/15189/getdatasheetpartid-329325-15189851.pdf?src-supplier=Verical; ComponentLink7Description: https://datasheet.ciiva.com/15189/getdatasheetpartid-329325-15189851.pdf?src-supplier=Verical; ComponentLink8URL: https://datasheet.ciiva.com/11808/0900766b80f96399-11808081.pdf?src-supplier=RSComponents; ComponentLink8Description: https://datasheet.ciiva.com/11808/0900766b80f96399-11808081.pdf?src-supplier=RSComponents; ComponentLink9URL: https://datasheet.ciiva.com/25906/pyu-rc0603-51-rohs-l-4-25906933.pdf?src-supplier=Avnet+Europe; ComponentLink9Description: https://datasheet.ciiva.com/25906/pyu-rc0603-51-rohs-l-4-25906933.pdf?src-supplier=Avnet+Europe; ComponentLink10URL: https://datasheet.ciiva.com/7660/1868787-7660790.pdf?src-supplier=Element14; ComponentLink10Description: https://datasheet.ciiva.com/7660/1868787-7660790.pdf?src-supplier=Element14; ComponentLink11URL: https://datasheet.ciiva.com/7746/1738695-7746279.pdf?src-supplier=Element14; ComponentLink11Description: https://datasheet.ciiva.com/7746/1738695-7746279.pdf?src-supplier=Element14; ComponentLink12URL: https://datasheet.ciiva.com/7746/1686128-7746280.pdf?src-supplier=Element14; ComponentLink12Description: https://datasheet.ciiva.com/7746/1686128-7746280.pdf?src-supplier=Element14; ComponentLink13URL: https://datasheet.ciiva.com/28386/pyu-rc0603-51-rohs-l-4-28386648.pdf?src-supplier=Avnet+Europe; ComponentLink13Description: https://datasheet.ciiva.com/28386/pyu-rc0603-51-rohs-l-4-28386648.pdf?src-supplier=Avnet+Europe; ComponentLink14URL: https://datasheet.ciiva.com/7746/1738695-7746281.pdf?src-supplier=Element14; ComponentLink14Description: https://datasheet.ciiva.com/7746/1738695-7746281.pdf?src-supplier=Element14; ComponentLink15URL: https://datasheet.ciiva.com/8896/pyu-rc0603-51-rohs-l-4-8896106.pdf?src-supplier=Avnet; ComponentLink15Description: https://datasheet.ciiva.com/8896/pyu-rc0603-51-rohs-l-4-8896106.pdf?src-supplier=Avnet; ComponentLink16URL: https://datasheet.ciiva.com/15189/getdatasheetpartid-404327-15189644.pdf?src-supplier=Verical; ComponentLink16Description: https://datasheet.ciiva.com/15189/getdatasheetpartid-404327-15189644.pdf?src-supplier=Verical; ComponentLink17URL: https://datasheet.ciiva.com/7983/443971-7983613.pdf?src-supplier=Element14; ComponentLink17Description: https://datasheet.ciiva.com/7983/443971-7983613.pdf?src-supplier=Element14; Supplier 1: Digi-Key; Supplier Part Number 1: 311-10KGRCT-ND; Stock 1: 433267; Pricing 1: 1=0.10000, 10=0.01900, 100=0.00770, 1000=0.00347, 2500=0.00301 (USD); RoHS: Yes; Case/Package: 0603; Number of Pins: 2; Contact Plating: Tin,Matte; Case Code (Imperial): 0603; Case Code (Metric): 1608; Min Operating Temperature: -55°C; Max Operating Temperature: 155°C; Packaging: Tape and Reel; Tolerance: 5%; Composition: Thick Film; Voltage Rating: 50V; Termination: SMD/SMT; Military Standard: Not; Features: Moisture Resistant; Max Power Dissipation: 100mW; Number of Terminations: 2; Length: 0.063inch; Width: 0.031inch; Depth: 0.8mm; Height - Seated (Max): 0.022inch; Radiation Hardening: No; REACH SVHC: Unknown; Lead Free: Lead Free; ComponentLink18URL: https://datasheet.ciiva.com/2452/pyu-rc-group-51-rohs-l-10-2452848.pdf?src-supplier=Digi-Key; ComponentLink18Description: https://datasheet.ciiva.com/2452/pyu-rc-group-51-rohs-l-10-2452848.pdf?src-supplier=Digi-Key
RP = Res1: RES SMD 1K OHM 1% 1/10W 0603; Manufacturer: Yageo; Manufacturer Part Number: RC0603FR-071KL; Temperature Coefficient: 100ppm/°C; Resistance: 1kR; Power Rating: 100mW; Voltage Rating: 50V; ComponentLink1URL: https://datasheet.ciiva.com/2452/pyu-r-int-thick-7-2452944.pdf?src-supplier=Digi-Key; ComponentLink1Description: https://datasheet.ciiva.com/2452/pyu-r-int-thick-7-2452944.pdf?src-supplier=Digi-Key; ComponentLink2URL: https://datasheet.ciiva.com/2452/pyu-r-int-thick-7-2452945.pdf?src-supplier=Digi-Key; ComponentLink2Description: https://datasheet.ciiva.com/2452/pyu-r-int-thick-7-2452945.pdf?src-supplier=Digi-Key; ComponentLink3URL: https://datasheet.ciiva.com/2452/pyu-r-int-thick-7-2452946.pdf?src-supplier=Digi-Key; ComponentLink3Description: https://datasheet.ciiva.com/2452/pyu-r-int-thick-7-2452946.pdf?src-supplier=Digi-Key; ComponentLink4URL: https://datasheet.ciiva.com/7746/443971-7746453.pdf?src-supplier=Element14; ComponentLink4Description: https://datasheet.ciiva.com/7746/443971-7746453.pdf?src-supplier=Element14; ComponentLink5URL: https://datasheet.ciiva.com/7746/443971-7746454.pdf?src-supplier=Element14; ComponentLink5Description: https://datasheet.ciiva.com/7746/443971-7746454.pdf?src-supplier=Element14; ComponentLink6URL: https://datasheet.ciiva.com/6063/1868787-6063175.pdf?src-supplier=Farnell; ComponentLink6Description: https://datasheet.ciiva.com/6063/1868787-6063175.pdf?src-supplier=Farnell; ComponentLink7URL: https://datasheet.ciiva.com/15189/getdatasheetpartid-329325-15189851.pdf?src-supplier=Verical; ComponentLink7Description: https://datasheet.ciiva.com/15189/getdatasheetpartid-329325-15189851.pdf?src-supplier=Verical; Supplier 1: Digi-Key; Supplier Part Number 1: 311-1.00KHRDKR-ND; Stock 1: 31104604; Pricing 1: 1=0.10000, 10=0.02300, 100=0.00940, 1000=0.00421, 2500=0.00366 (USD); RoHS: Yes; Case/Package: 0603; Contact Plating: Tin,Matte; Case Code (Imperial): 0603; Case Code (Metric): 1608; Min Operating Temperature: -55°C; Max Operating Temperature: 155°C; Composition: Thick Film; Tolerance: 1%; Packaging: Tape and Reel; Military Standard: Not; Termination: SMD/SMT; Length: 1.6mm; Height: 0.45mm; Depth: 0.8mm; Radiation Hardening: No; Lead Free: Lead Free; REACH SVHC: No SVHC; ComponentLink8URL: https://datasheet.ciiva.com/11808/0900766b80f96399-11808081.pdf?src-supplier=RSComponents; ComponentLink8Description: https://datasheet.ciiva.com/11808/0900766b80f96399-11808081.pdf?src-supplier=RSComponents; ComponentLink9URL: https://datasheet.ciiva.com/25906/pyu-rc0603-51-rohs-l-4-25906933.pdf?src-supplier=Avnet+Europe; ComponentLink9Description: https://datasheet.ciiva.com/25906/pyu-rc0603-51-rohs-l-4-25906933.pdf?src-supplier=Avnet+Europe; ComponentLink10URL: https://datasheet.ciiva.com/7660/1868787-7660790.pdf?src-supplier=Element14; ComponentLink10Description: https://datasheet.ciiva.com/7660/1868787-7660790.pdf?src-supplier=Element14; ComponentLink11URL: https://datasheet.ciiva.com/7746/1738695-7746279.pdf?src-supplier=Element14; ComponentLink11Description: https://datasheet.ciiva.com/7746/1738695-7746279.pdf?src-supplier=Element14; ComponentLink12URL: https://datasheet.ciiva.com/7746/1686128-7746280.pdf?src-supplier=Element14; ComponentLink12Description: https://datasheet.ciiva.com/7746/1686128-7746280.pdf?src-supplier=Element14; ComponentLink13URL: https://datasheet.ciiva.com/28386/pyu-rc0603-51-rohs-l-4-28386648.pdf?src-supplier=Avnet+Europe; ComponentLink13Description: https://datasheet.ciiva.com/28386/pyu-rc0603-51-rohs-l-4-28386648.pdf?src-supplier=Avnet+Europe; ComponentLink14URL: https://datasheet.ciiva.com/7746/1738695-7746281.pdf?src-supplier=Element14; ComponentLink14Description: https://datasheet.ciiva.com/7746/1738695-7746281.pdf?src-supplier=Element14; ComponentLink15URL: https://datasheet.ciiva.com/8896/pyu-rc0603-51-rohs-l-4-8896106.pdf?src-supplier=Avnet; ComponentLink15Description: https://datasheet.ciiva.com/8896/pyu-rc0603-51-rohs-l-4-8896106.pdf?src-supplier=Avnet; ComponentLink16URL: https://datasheet.ciiva.com/15189/getdatasheetpartid-404327-15189644.pdf?src-supplier=Verical; ComponentLink16Description: https://datasheet.ciiva.com/15189/getdatasheetpartid-404327-15189644.pdf?src-supplier=Verical; ComponentLink17URL: https://datasheet.ciiva.com/7983/443971-7983613.pdf?src-supplier=Element14; ComponentLink17Description: https://datasheet.ciiva.com/7983/443971-7983613.pdf?src-supplier=Element14
SP_SELECTOR = Header 4: CONN HEADER VERT 4POS 2.54MM; Manufacturer 1: Sullins; Manufacturer Part Number 1: PREC004SFAN-RC; Number of Positions: 4; Connector Type: Male Pin; Pitch: 0.1inch; LatestRevisionDate: 17-Jul-2002; LatestRevisionNote: Re-released for DXP Platform.; Publisher: Altium Limited; Supplier 1: Digi-Key; Supplier Part Number 1: S1212EC-04-ND; Stock 1: 4924; Pricing 1: 1=0.13000, 10=0.12600, 25=0.09400, 50=0.08060, 100=0.07800, 250=0.06720, 500=0.06452 (USD); RoHS: Yes; Mount: Through Hole; Color: Black; Contact Plating: Tin; Package Quantity: 1; Number of Rows: 1; Packaging: Bulk; Termination: Solder; Series: -; Contact Type: Male Pin; Contact Mating Length: 0.318inch; RoHS Compliant: Yes; ComponentLink1URL: https://datasheet.ciiva.com/740/xrxczzzsxxn-rc-st-11635-b-740961.pdf?src-supplier=Digi-Key; ComponentLink1Description: https://datasheet.ciiva.com/740/xrxczzzsxxn-rc-st-11635-b-740961.pdf?src-supplier=Digi-Key
STROBE = Header 2: Connector Header Through Hole 2 position 0.079" (2.00mm); Manufacturer 1: JST; Manufacturer Part Number 1: B2BPHKSLFSN; Contact Resistance: 20mR; Max Current Rating: 2A; Number of Poles: 2; Voltage Rating: 100V; Insulation Resistance: 1MR; Gender: Male; Pitch: 2mm; Contact Post Length: 0.134inch; Mated Stacking Heights: 8mm; ComponentLink1URL: https://datasheet.ciiva.com/6747/80560-6747401.pdf?src-supplier=Newark; ComponentLink1Description: https://datasheet.ciiva.com/6747/80560-6747401.pdf?src-supplier=Newark; ComponentLink2URL: https://datasheet.ciiva.com/11746/0900766b80826550-11746939.pdf?src-supplier=RSComponents; ComponentLink2Description: https://datasheet.ciiva.com/11746/0900766b80826550-11746939.pdf?src-supplier=RSComponents; ComponentLink3URL: https://datasheet.ciiva.com/26894/getdatasheetpartid-448114-26894774.pdf?src-supplier=Verical; ComponentLink3Description: https://datasheet.ciiva.com/26894/getdatasheetpartid-448114-26894774.pdf?src-supplier=Verical; ComponentLink4URL: https://datasheet.ciiva.com/712/eph-712455.pdf?src-supplier=Digi-Key; ComponentLink4Description: https://datasheet.ciiva.com/712/eph-712455.pdf?src-supplier=Digi-Key; ComponentLink5URL: https://datasheet.ciiva.com/26924/getdatasheetpartid-651387-26924028.pdf?src-supplier=Verical; ComponentLink5Description: https://datasheet.ciiva.com/26924/getdatasheetpartid-651387-26924028.pdf?src-supplier=Verical; ComponentLink6URL: https://datasheet.ciiva.com/16200/eph-16200926.pdf?src-supplier=Future+Electronics; ComponentLink6Description: https://datasheet.ciiva.com/16200/eph-16200926.pdf?src-supplier=Future+Electronics; ComponentLink7URL: https://datasheet.ciiva.com/43491/741202-da-01-en-stiftleiste-gerade-3-pol-rm2-0-43491962.pdf?src-supplier=Conrad; ComponentLink7Description: https://datasheet.ciiva.com/43491/741202-da-01-en-stiftleiste-gerade-3-pol-rm2-0-43491962.pdf?src-supplier=Conrad; Supplier 1: Newark; Stock 1: 41838; Pricing 1: 1=0.183000, 10=0.172000, 100=0.123000, 500=0.104000, 1000=0.087000, 5000=0.075000 (USD); RoHS: Yes; Mount: Through Hole; Number of Pins: 2; Contact Material: Brass; Contact Plating: Tin,Copper; Color: Natural; Housing Color: White; Housing Material: Polyamide; Contact Shape: Square; Contact Finish - Mating: TIN; Insulation Material: Nylon; Insulation Color: Natural; Min Operating Temperature: -25°C; Max Operating Temperature: 85°C; Number of Rows: 1; Current Rating: 2A; Voltage Rating (AC): 100V; Packaging: Bulk; Number of Positions: 2; Termination: Press-Fit; Fastening Type: Detent; Max Voltage Rating (AC): 100V; Number of Contacts: 2; Working Voltage: 100V; Max Voltage Rating (DC): 100V; Orientation: Straight; Connector Type: Header; Series: PH; Contact Type: Male Pin; Length: 5.9mm; Width: 4.5mm; Height: 9.4mm; Lead Pitch: 2mm; Contact Mating Length: 0.13inch; Depth: 4.5mm; Insulation Height: 0.236inch; REACH SVHC: No SVHC; Lead Free: Lead Free; Flammability Rating: UL94 V-0; ComponentLink8URL: https://datasheet.ciiva.com/11746/0900766b8082f551-11746676.pdf?src-supplier=RSComponents; ComponentLink8Description: https://datasheet.ciiva.com/11746/0900766b8082f551-11746676.pdf?src-supplier=RSComponents; ComponentLink9URL: https://datasheet.ciiva.com/6747/80560-6747392.pdf?src-supplier=Newark; ComponentLink9Description: https://datasheet.ciiva.com/6747/80560-6747392.pdf?src-supplier=Newark; ComponentLink10URL: https://datasheet.ciiva.com/712/eph-712442.pdf?src-supplier=Digi-Key; ComponentLink10Description: https://datasheet.ciiva.com/712/eph-712442.pdf?src-supplier=Digi-Key; ComponentLink11URL: https://datasheet.ciiva.com/16422/b2b-ph-k-slfsn-16422715.pdf?src-supplier=Future+Electronics; ComponentLink11Description: https://datasheet.ciiva.com/16422/b2b-ph-k-slfsn-16422715.pdf?src-supplier=Future+Electronics; ComponentLink12URL: https://datasheet.ciiva.com/8052/80560-8052022.pdf?src-supplier=Element14; ComponentLink12Description: https://datasheet.ciiva.com/8052/80560-8052022.pdf?src-supplier=Element14
U1-U3 = SN74HC595NE4: Counter Shift Registers 8-Bit Shift Register; Manufacturer 1: Texas Instruments; Number of Circuits: 4; Number of Output Lines: 10; Number of Bits per Element: 8; Turn-On Delay Time: 250ns; Max Supply Voltage: 6V; Operating Supply Voltage: 5V; Min Supply Voltage: 2V; Number of Elements: 1; Direction: Unidirectional; Supplier 1: Digi-Key; Manufacturer Part Number 1: SN74HC595NE4; Stock 1: 1779; Pricing 1: 1=0.57000, 10=0.48800, 25=0.45520, 100=0.36400, 250=0.33800, 500=0.28600, 1000=0.22100, 2500=0.20150, 5000=0.18850 (USD); RoHS: Yes; Mount: Through Hole; Case/Package: PDIP; Number of Pins: 16; Weight: 0.03357oz; Min Operating Temperature: -40°C; Max Operating Temperature: 85°C; Number of Bits: 8; Package Quantity: 25; Packaging: Rail/Tube; Propagation Delay: 250ns; Logic Function: Shift Register; Radiation Hardening: No; Lead Free: Lead Free; ComponentLink1URL: https://datasheet.ciiva.com/15093/getdatasheetpartid-37319-15093075.pdf?src-supplier=Verical; ComponentLink1Description: https://datasheet.ciiva.com/15093/getdatasheetpartid-37319-15093075.pdf?src-supplier=Verical; ComponentLink2URL: https://datasheet.ciiva.com/18575/sn74hc595-18575023.pdf?src-supplier=Digi-Key; ComponentLink2Description: https://datasheet.ciiva.com/18575/sn74hc595-18575023.pdf?src-supplier=Digi-Key; Supplier Part Number 1: 296-36142-5-ND

## Nets that join several sheets
5V: Rotary (8 pins), LEDController (29 pins)
9V: PowerSupply (7 pins), LEDController (POWER.1)
GND: Rotary (33 pins), PowerSupply (15 pins), LEDController (36 pins)
VLED: PowerSupply (P_JUMPER.2 P_JUMPER.4 P_JUMPER.6), LEDController (P_LED1.1 P_LED2.1)
RCLK2: Rotary (U4.12 U5.12 U6.12), LEDController (DIGITAL.5)
ROT1: Rotary (ROTARY1.11), LEDController (AD_H.8)
ROT2: Rotary (ROTARY2.11), LEDController (AD_H.7)
~{SRCLK}: Rotary (U4.10 U5.10 U6.10), LEDController (DIGITAL.9)
SER2: Rotary (U4.14 U5.14 U6.14), LEDController (DIGITAL.3)
SRCLK: Rotary (U4.11 U5.11 U6.11), LEDController (DIGITAL.7)